# Altium project SecuCar.PrjPcb
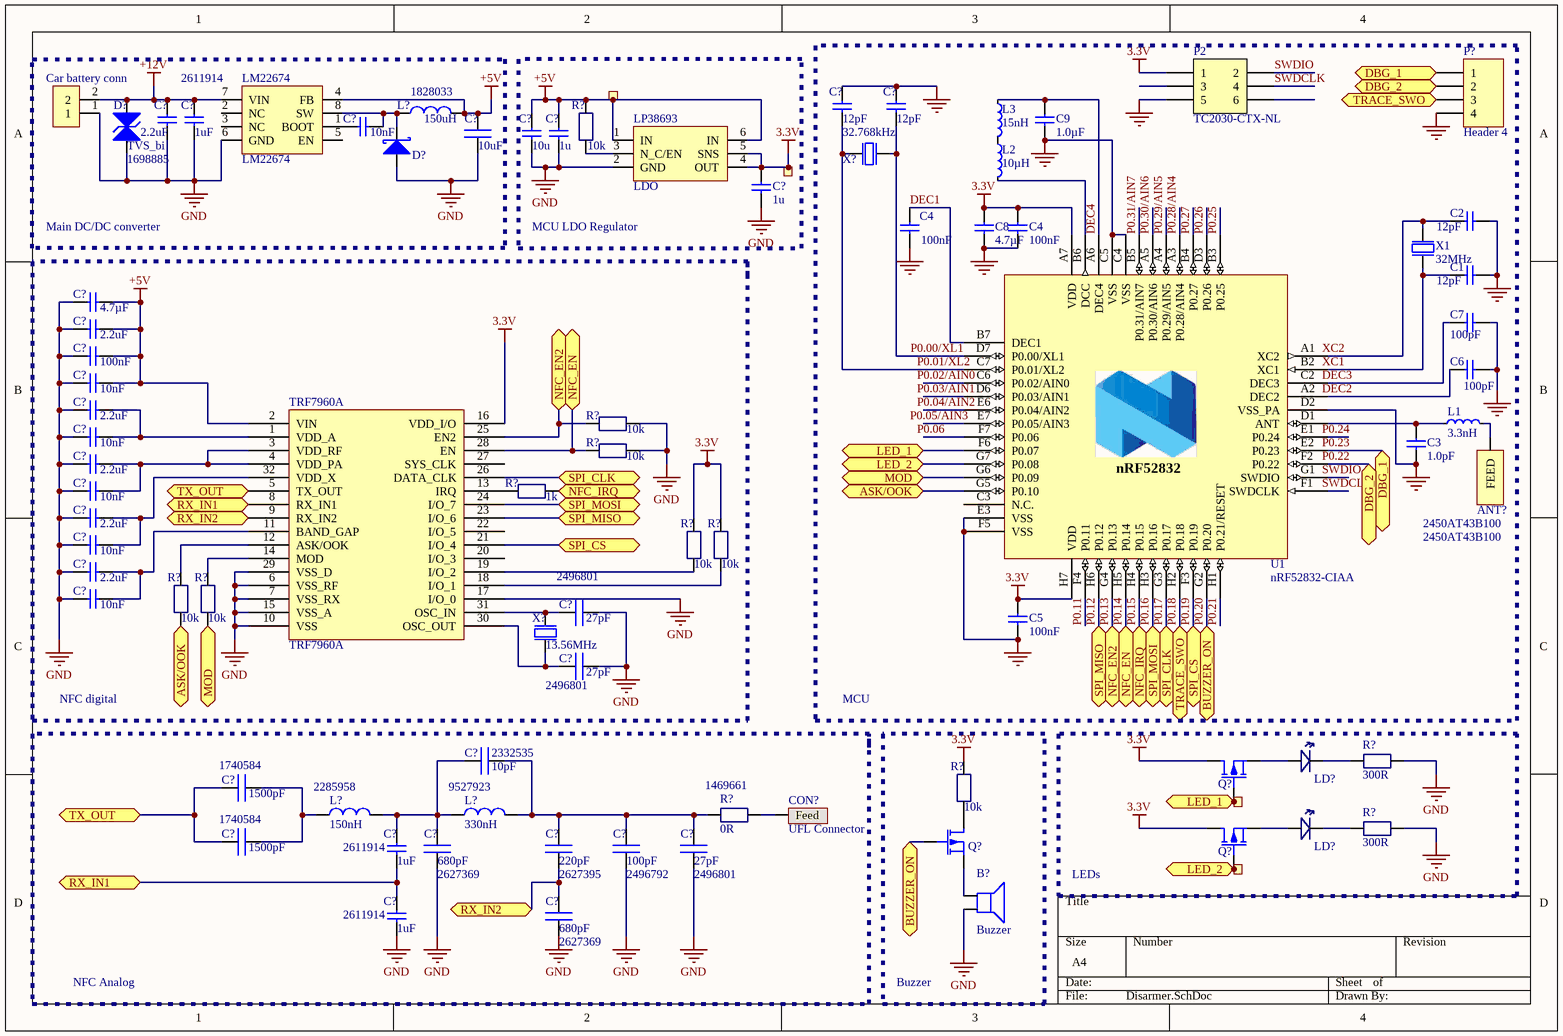
[diagram p0: Disarmer.SchDoc]
3 sheets, 235 parts. Net scope: flat (ports and power ports of the same name join across sheets).
Sheets:
  Disarmer.SchDoc
  MainBoard.SchDoc
  MainBoardPower.SchDoc

## Sheet Disarmer.SchDoc
size A4

### Parts
(Parts that share a designator on the sheet are numbered #1, #2 ... from top to bottom, then left to right.)
?#1  Ø1.0mm,SMD  [TP_SMD_Ř1.0mm]  (value not drawn)  (no BOM)
?#2  Ø1.0mm,SMD  [TP_SMD_Ř1.0mm]  (value not drawn)  (no BOM)
?#3  Ø1.0mm,SMD  [TP_SMD_Ř1.0mm]  (value not drawn)  (no BOM)
?#4  Ø1.0mm,SMD  [TP_SMD_Ř1.0mm]  (value not drawn)  (no BOM)
ANT?#1  2450AT43B100  [2450AT43B100]
B?  Buzzer  [Buzzer_12mm]
C1  12pF  [CAPC0603X03L]
C2  12pF  [CAPC0603X03L]
C3  1.0pF  [CAPC0603X03L]
C4#1  100nF  [CAPC0603X03L]
C4#2  100nF  [CAPC0603X03L]
C5  100nF  [CAPC0603X03L]
C6  100pF  [CAPC0603X03L]
C7  100pF  [CAPC0603X03L]
C8  4.7µF  [CAPC1608X06L]
C9  1.0µF  [CAPC1005X04L]
C?#1  2.2uF  [CAPC1608X06L]
C?#2  1uF  Supplier Part Number 1: 2611914  [CAPC1608X06L]
C?#3  10u  [CAPC1608X06L]
C?#4  1u  [CAPC1608X06L]
C?#5  10nF  [CAPC0603X03L]
C?#6  12pF  [CAPC0603X03L]
C?#7  12pF  [CAPC0603X03L]
C?#8  10uF  [0805]
C?#9  1u  [CAPC1608X06L]
C?#10  4.7µF  [CAPC1608X06L]
C?#11  2.2uF  [CAPC1608X06L]
C?#12  100nF  [CAPC0603X03L]
C?#13  10nF  [CAPC0603X03L]
C?#14  2.2uF  [CAPC1608X06L]
C?#15  10nF  [CAPC0603X03L]
C?#16  2.2uF  [CAPC1608X06L]
C?#17  10nF  [CAPC0603X03L]
C?#18  2.2uF  [CAPC1608X06L]
C?#19  10nF  [CAPC0603X03L]
C?#20  2.2uF  [CAPC1608X06L]
C?#21  10nF  [CAPC0603X03L]
C?#22  27pF  Supplier Part Number 1: 2496801  [0402]
C?#23  27pF  Supplier Part Number 1: 2496801  [0402]
C?#24  10pF  Supplier Part Number 1: 2332535  [0402]
C?#25  1500pF  Supplier Part Number 1: 1740584  [0402]
C?#26  1uF  Supplier Part Number 1: 2611914  [CAPC1608X06L]
C?#27  1500pF  Supplier Part Number 1: 1740584  [0402]
C?#28  27pF  Supplier Part Number 1: 2496801  [0402]
C?#29  680pF  Supplier Part Number 1: 2627369  [0402]
C?#30  220pF  Supplier Part Number 1: 2627395  [0402]
C?#31  100pF  Supplier Part Number 1: 2496792  [0402]
C?#32  1uF  Supplier Part Number 1: 2611914  [CAPC1608X06L]
C?#33  680pF  Supplier Part Number 1: 2627369  [0402]
Car_battery_conn  (no value)  [ARK_3.5mm]
CON?  UFL Connector  [UFL SMD]
D?#1  TVS_bi  Supplier Part Number 1: 1698885  [DO-214-AB]
D?#2  Shottky  [SOD123F]  (value not drawn)
L1  3.3nH  [INDC0603X03L]
L2#1  10µH  [INDC1608X06L]
L3#1  15nH  [INDC1005X04L]
L?#1  150uH  Supplier Part Number 1: 1828033  [8x8]
L?#2  150nH  Supplier Part Number 1: 2285958  [0603]
L?#3  330nH  Supplier Part Number 1: 9527923  [0805]
LD?#1  0603_LED  [LED_0603]  (value not drawn)
LD?#2  0603_LED  [LED_0603]  (value not drawn)
LM22674  LM22674  [HSOP 8-pin]
LP38693#1  LDO  [WSON-6]
P2#1  TC2030-CTX-NL  [TC2030-IDC-NLFP]  (no BOM)
P?#1  Header 4  [HDR1X4]
Q?#1  RZE002P02TLTR-ND  [SOT-416]  (value not drawn)
Q?#2  RZE002P02TLTR-ND  [SOT-416]  (value not drawn)
Q?#3  RZE002P02TLTR-ND  [SOT-416]  (value not drawn)
R?#1  value 10k  [RES_0402]  (hidden comment: RES_0402_1k)
R?#2  value 10k  [RES_0402]  (hidden comment: RES_0402_1k)
R?#3  value 10k  [RES_0402]  (hidden comment: RES_0402_1k)
R?#4  value 1k  [RES_0402]  (hidden comment: RES_0402_1k)
R?#5  value 10k  [RES_0402]  (hidden comment: RES_0402_1k)
R?#6  value 10k  [RES_0402]  (hidden comment: RES_0402_1k)
R?#7  value 10k  [RES_0402]  (hidden comment: RES_0402_1k)
R?#8  value 10k  [RES_0402]  (hidden comment: RES_0402_1k)
R?#9  value 300R  [RES_0402]  (hidden comment: RES_0402_1k)
R?#10  value 10k  [RES_0402]  (hidden comment: RES_0402_1k)
R?#11  value 0R  Supplier Part Number 2: 1469661  [RES_0402]  (hidden comment: RES_0402_1k)
R?#12  value 300R  [RES_0402]  (hidden comment: RES_0402_1k)
TRF7960A  TRF7960A  [RHB32]
U1#1  nRF52832-CIAA  [BGA50C40P7X8_295X322X50]
X1  32MHz  [BT-XTAL_2016]
X?#1  32.768kHz  [XTAL_2012]
X?#2  13.56MHz  [BT-XTAL_2016]

### Blocks framed on the sheet
Main DC/DC converter: C?#1 C?#2 C?#5 C?#8 Car_battery_conn D?#1 D?#2 L?#1 LM22674
MCU LDO Regulator: ?#1 ?#2 C?#3 C?#4 C?#9 LP38693#1 R?#1
MCU: ANT?#1 C1-C3 C4#1 C4#2 C5-C9 C?#6 C?#7 L1 L2#1 L3#1 P2#1 P?#1 U1#1 X1 X?#1
Buzzer: B? Q?#2 R?#10
LEDs: ?#3 ?#4 LD?#1 LD?#2 Q?#1 Q?#3 R?#9 R?#12

### Ports
ASK/OOK, BUZZER_ON, DBG_1, DBG_2, LED_1, LED_2, MOD, NFC_EN, NFC_EN2, NFC_IRQ, RX_IN1, RX_IN2, SPI_CLK, SPI_CS, SPI_MISO, SPI_MOSI, TRACE_SWO, TX_OUT

### Nets
3.3V: ?#2.1 C4#2.1 C5.1 C8.1 C?#9.1 LP38693#1.4(OUT) LP38693#1.5(SNS) P2#1.1 Q?#1.3 Q?#3.3 R?#5.2 R?#6.2 R?#10.1 TRF7960A.16(VDD_I/O) U1#1.A7(VDD) U1#1.H7(VDD)
+5V: ?#1.1 C?#3.1 C?#4.1 C?#8.2 C?#10.2 C?#11.1 C?#12.2 C?#13.2 L?#1.2 LM22674.4(FB) LP38693#1.1(IN) LP38693#1.6(IN) R?#1.2 TRF7960A.2(VIN)
+12V: C?#1.1 C?#2.1 Car_battery_conn.2 D?#1.2 LM22674.7(VIN)
GND: B?.2 C1.1 C2.1 C3.1 C4#1.2 C4#2.2 C5.2 C6.1 C7.2 C8.2 C9.1 C?#1.2 C?#2.2 C?#3.2 C?#4.2 C?#6.2 C?#7.2 C?#8.1 C?#9.2 C?#10.1 C?#11.2 C?#12.1 C?#13.1 C?#14.2 C?#15.1 C?#16.2 C?#17.1 C?#18.2 C?#19.1 C?#20.2 C?#21.1 C?#22.1 C?#23.1 C?#28.2 C?#29.1 C?#31.1 C?#32.2 C?#33.1 Car_battery_conn.1 CON?.2(GND) D?#1.1 D?#2.1 LM22674.6(GND) LP38693#1.2(GND) P2#1.5 P?#1.4 R?#2.1 R?#3.1 R?#9.1 R?#12.1 TRF7960A.6(VSS_RF) TRF7960A.7(VSS_RX) TRF7960A.10(VSS) TRF7960A.15(VSS_A) TRF7960A.17(I/O_0) TRF7960A.29(VSS_D) U1#1.C4(VSS) U1#1.C5(VSS) U1#1.D2(VSS_PA) U1#1.E3(VSS) U1#1.F5(VSS) X1.2(GND) X1.4(GND) X?#2.2(GND) X?#2.4(GND)
DEC1: C4#1.1 U1#1.B7(DEC1)
DEC4: C9.2 L3#1.1 U1#1.A6(DEC4)
P0.00/XL1: C?#7.1 U1#1.D7(P0.00/XL1) X?#1.2(out)
P0.01/XL2: C?#6.1 U1#1.C7(P0.01/XL2) X?#1.1(inp)
P0.11: U1#1.F4(P0.11)
P0.12: TRF7960A.23(I/O_6) U1#1.H6(P0.12) ; port SPI_MISO
P0.13: R?#2.2 TRF7960A.25(EN2) U1#1.G4(P0.13) ; port NFC_EN2
P0.14: R?#3.2 TRF7960A.28(EN) U1#1.H5(P0.14) ; port NFC_EN
P0.15: R?#4.2 U1#1.H4(P0.15) ; port NFC_IRQ
P0.16: TRF7960A.24(I/O_7) U1#1.H3(P0.16) ; port SPI_MOSI
P0.17: TRF7960A.26(DATA_CLK) U1#1.G3(P0.17) ; port SPI_CLK
P0.18: P?#1.3 U1#1.H2(P0.18) ; port TRACE_SWO
P0.19: TRF7960A.21(I/O_4) U1#1.F3(P0.19) ; port SPI_CS
P0.20: Q?#2.1 U1#1.G2(P0.20) ; port BUZZER_ON
P0.21: U1#1.H1(P0.21/RESET)
P0.25: U1#1.B3(P0.25)
P0.26: U1#1.D3(P0.26)
P0.27: U1#1.B4(P0.27)
P0.28/AIN4: U1#1.A3(P0.28/AIN4)
P0.29/AIN5: U1#1.A4(P0.29/AIN5)
P0.30/AIN6: U1#1.A5(P0.30/AIN6)
P0.31/AIN7: U1#1.B5(P0.31/AIN7)
SWDCLK: P2#1.4
SWDIO: P2#1.2
Net?#3_1: ?#3.1 Q?#1.1 U1#1.F6(P0.07) ; port LED_1
Net?#4_1: ?#4.1 Q?#3.1 U1#1.G7(P0.08) ; port LED_2
NetANT?#1_1: ANT?#1.1(FEED) L1.2
NetB?_1: B?.1 Q?#2.2
NetC1_2: C1.2 U1#1.B2(XC1) X1.1(inp)
NetC2_2: C2.2 U1#1.A1(XC2) X1.3(out)
NetC3_2: C3.2 L1.1 U1#1.D1(ANT)
NetC6_2: C6.2 U1#1.A2(DEC2)
NetC7_1: C7.1 U1#1.C2(DEC3)
NetC?#5_1: C?#5.1 D?#2.2 L?#1.1 LM22674.8(SW)
NetC?#5_2: C?#5.2 LM22674.1(BOOT)
NetC?#14_1: C?#14.1 C?#15.2 TRF7960A.1(VDD_A)
NetC?#16_1: C?#16.1 C?#17.2 TRF7960A.3(VDD_RF) TRF7960A.4(VDD_PA)
NetC?#18_1: C?#18.1 C?#19.2 TRF7960A.32(VDD_X)
NetC?#20_1: C?#20.1 C?#21.2 TRF7960A.11(BAND_GAP)
NetC?#22_2: C?#22.2 TRF7960A.31(OSC_IN) X?#2.3(out)
NetC?#23_2: C?#23.2 TRF7960A.30(OSC_OUT) X?#2.1(inp)
NetC?#24_1: C?#24.1 C?#28.1 C?#30.2 C?#31.2 L?#3.2 R?#11.2
NetC?#24_2: C?#24.2 C?#26.1 C?#29.2 L?#2.2 L?#3.1
NetC?#25_1: C?#25.1 C?#27.1 TRF7960A.5(TX_OUT) ; port TX_OUT
NetC?#25_2: C?#25.2 C?#27.2 L?#2.1
NetC?#26_2: C?#26.2 C?#32.1 TRF7960A.8(RX_IN1) ; port RX_IN1
NetC?#30_1: C?#30.1 C?#33.2 TRF7960A.9(RX_IN2) ; port RX_IN2
NetCON?_1: CON?.1(Feed) R?#11.1
NetL2#1_1: L2#1.1 L3#1.2
NetL2#1_2: L2#1.2 U1#1.B6(DCC)
NetLD?#1_1: LD?#1.1(A) Q?#1.2
NetLD?#1_2: LD?#1.2(K) R?#9.2
NetLD?#2_1: LD?#2.1(A) Q?#3.2
NetLD?#2_2: LD?#2.2(K) R?#12.2
NetLP38693#1_3: LP38693#1.3(N_C/EN) R?#1.1
NetP?#1_1: P?#1.1 U1#1.E2(P0.23) ; port DBG_1
NetP?#1_2: P?#1.2 U1#1.F2(P0.22) ; port DBG_2
NetQ?#2_3: Q?#2.3 R?#10.2
NetR?#4_1: R?#4.1 TRF7960A.13(IRQ)
NetR?#5_1: R?#5.1 TRF7960A.19(I/O_2)
NetR?#6_1: R?#6.1 TRF7960A.18(I/O_1)
NetR?#7_1: R?#7.1 U1#1.G5(P0.10) ; port ASK/OOK
NetR?#7_2: R?#7.2 TRF7960A.12(ASK/OOK)
NetR?#8_1: R?#8.1 U1#1.G6(P0.09) ; port MOD
NetR?#8_2: R?#8.2 TRF7960A.14(MOD)

Not connected (* = marked no-connect by the designer): LM22674 2(NC) 3(NC) 5(EN); P2#1 3 6; TRF7960A 20(I/O_3) 22(I/O_5) 27(SYS_CLK); U1#1 C3(N.C.) C6(P0.02/AIN0) D6(P0.03/AIN1) E1(P0.24) E6(P0.04/AIN2) E7(P0.05/AIN3) F1(SWDCLK) F7(P0.06) G1(SWDIO)

### Notes on the sheet
- NFC digital
- NFC Analog
- Labels drawn without touching a wire or pin: DEC2, DEC3, P0.02/AIN0, P0.03/AIN1, P0.04/AIN2, P0.05/AIN3, P0.06, P0.22, P0.23, P0.24, SWDCLK, SWDIO, XC1, XC2
- (in symbol nRF52832-CIAA) nRF52832

### Library data of the parts
?#1-?#4 = TESTPAD: 1.0mm circular SMD testpad; Part Number: TP_SMD_Ø1.0MM; Manufacturer: Nordic Semiconductor; Artikkelnr Noca: N.A.; Manufacturer Part Number: *; Datasheet: *; Footprint: TP_SMD_Ø1.0mm; LatestRevisionDate: 2013-06-11; Pin Count: 1; Publisher: Nordic Semiconductor; Published: 2013-06-11; Value: Ø1.0mm,SMD; Note: *; Supplier: *; Supplier part number: *; 2nd source Supplier: *; 2nd source part number: *
C1 C2 C?#6 C?#7 = C0201-12p: Capacitor, NP0, ±2%; Note: 50V; Artikkelnr Noca: N.A.; Part Number: C0201-12p; Manufacturer: *; Manufacturer Part Number: *; Datasheet: *; LatestRevisionDate: 2014-11-13; Pin Count: 2; Publisher: Nordic Semiconductor; Published: 2014-11-13; Value: 12pF; Supplier: *; Supplier part number: *; 2nd source Supplier: *; 2nd source part number: *; Footprint Doc: 0201; Artikkelnr Simpro: N.A.
C3 = C0201-1.0p: Capacitor, NP0, ±5%; Note: Chip Cap 1%; Artikkelnr Noca: N.A.; Part Number: C0201-1.0p; Manufacturer: *; Manufacturer Part Number: *; Datasheet: *; LatestRevisionDate: 2014-11-13; Pin Count: 2; Publisher: Nordic Semiconductor; Published: 2014-11-13; Value: 1.0pF; Supplier: *; Supplier part number: *; 2nd source Supplier: *; 2nd source part number: *; Footprint Doc: 0201; Artikkelnr Simpro: N.A.
C4#1 C4#2 C5 C?#12 = C0201-100n: Capacitor, X7R, ±10%; Note: 16V; Artikkelnr Noca: N.A.; Part Number: C0201-100n; Manufacturer: *; Manufacturer Part Number: *; Datasheet: *; LatestRevisionDate: 2014-11-13; Pin Count: 2; Publisher: Nordic Semiconductor; Published: 2014-11-13; Value: 100nF; Supplier: *; Supplier part number: *; 2nd source Supplier: *; 2nd source part number: *; Footprint Doc: 0201; Artikkelnr Simpro: N.A.
C6 C7 = C0201-100p: Capacitor, NP0, ±5%; Note: Chip Cap 1%; Artikkelnr Noca: N.A.; Part Number: C0201-100p; Manufacturer: *; Manufacturer Part Number: *; Datasheet: *; LatestRevisionDate: 2014-11-13; Pin Count: 2; Publisher: Nordic Semiconductor; Published: 2014-11-13; Value: 100pF; Supplier: *; Supplier part number: *; 2nd source Supplier: *; 2nd source part number: *; Footprint Doc: 0201; Artikkelnr Simpro: N.A.
C8 C?#10 = C0603-4µ7: Capacitor, X5R, ±10%; Note: 6.3V; Artikkelnr Noca: 20069060; Artikkelnr Simpro: N.A.; Part Number: C0603-4µ7; Manufacturer: *; Manufacturer Part Number: *; Datasheet: *; LatestRevisionDate: 2009-11-23; Pin Count: 2; Publisher: Nordic Semiconductor; Published: 2009-05-08; Value: 4.7µF; Supplier: *; Supplier part number: *; 2nd source Supplier: *; 2nd source part number: *; Footprint Doc: 0603
C9 = C0402-1µ0: Capacitor, X5R, ±5%; Note: 6.3V; Artikkelnr Noca: 20039235; Artikkelnr Simpro: N.A.; Part Number: C0402-1µ0; Manufacturer: *; Manufacturer Part Number: *; Datasheet: *; LatestRevisionDate: 2009-11-23; Pin Count: 2; Publisher: Nordic Semiconductor; Published: 2009-05-08; Value: 1.0µF; Supplier: *; Supplier part number: *; 2nd source Supplier: *; 2nd source part number: *; Footprint Doc: 0402
C?#1-C?#4 C?#9 C?#11 C?#14 C?#16 C?#18 C?#20 C?#26 C?#32 = C0603-4µ7: Capacitor, X5R, ±10%; Value: 4.7µF; Note: 6.3V; Artikkelnr Noca: 20069060; Artikkelnr Simpro: N.A.; Part Number: C0603-4µ7; Manufacturer: *; Manufacturer Part Number: *; Datasheet: *; LatestRevisionDate: 2009-11-23; Pin Count: 2; Publisher: Nordic Semiconductor; Published: 2009-05-08; Supplier: *; Supplier part number: *; 2nd source Supplier: *; 2nd source part number: *; Footprint Doc: 0603
  C?#2 C?#26 C?#32: Supplier 1: Farnell
  C?#3 C?#4 C?#9: Supplier 1: Farnell; Supplier Part Number 1: 1327684
C?#5 C?#13 C?#15 C?#17 C?#19 C?#21 = C0201-100n: Capacitor, X7R, ±10%; Value: 100nF; Note: 16V; Artikkelnr Noca: N.A.; Part Number: C0201-100n; Manufacturer: *; Manufacturer Part Number: *; Datasheet: *; LatestRevisionDate: 2014-11-13; Pin Count: 2; Publisher: Nordic Semiconductor; Published: 2014-11-13; Supplier: *; Supplier part number: *; 2nd source Supplier: *; 2nd source part number: *; Footprint Doc: 0201; Artikkelnr Simpro: N.A.
C?#8 C?#22-C?#25 C?#27-C?#31 C?#33 = Capacitor_MLCC: ?
  C?#22-C?#25 C?#27-C?#31 C?#33: Supplier 1: Farnell
Car_battery_conn = Component_1
D?#1 = TVS_bidirectional: Supplier 1: Farnell
D?#2 = Shottky_diode
L1 = L0201-3n3: High frequency chip inductor ±5%; Artikkelnr Noca: N.A.; Part Number: L0201-3n3; Manufacturer: *; Manufacturer Part Number: *; Datasheet: *; LatestRevisionDate: 2013-04-10; Pin Count: 2; Publisher: Nordic Semiconductor; Published: 2013-04-10; Value: 3.3nH; Note: High frequency chip inductor ±5%; Supplier: *; Supplier part number: *; 2nd source Supplier: *; 2nd source part number: *; Footprint Doc: 0201; Artikkelnr Simpro: N.A.
L2#1 = L0603-10µ: Chip inductor, IDC,min = 50 mA, ±20%; Manufacturer: Taiyo Yuden; Manufacturer Part Number: LBMF1608T100K; 2nd source part number: 178-6105; Note: LBMF1608T100K 10µH 80mA 0603; Artikkelnr Noca: 33029314; Artikkelnr Simpro: N.A.; Part Number: L0603-10µ; Datasheet: http://www.yuden.co.jp/ut/product/pdf/elb2_e.pdf; LatestRevisionDate: 2012-09-19; Pin Count: 2; Publisher: Nordic Semiconductor; Published: 2010-02-24; Value: 10µH; Supplier: Digi-Key; Supplier part number: 587-1714-1-ND; 2nd source Supplier: Farnell; Footprint Doc: 0603
L3#1 = L0402-15n: High frequency chip inductor ±10%; Manufacturer: Taiyo Yuden; Manufacturer Part Number: HK100515NJ-T; 2nd source part number: 658-1328; Artikkelnr Noca: 33029323; Artikkelnr Simpro: N.A.; Part Number: L0402-15n; LatestRevisionDate: 2012-09-19; Pin Count: 2; Publisher: Nordic Semiconductor; Published: 2010-07-12; Value: 15nH; Note: High frequency chip inductor ±10%; Supplier: Digi-Key; Datasheet: http://www.yuden.co.jp/productdata/catalog/en/mlci04_e.pdf; Supplier part number: 587-1521-1-ND; 2nd source Supplier: Farnell; Footprint Doc: 0402
L?#1-L?#3 = Inductor: Supplier 1: Farnell
LD?#1 LD?#2 = LED_0603_Blue: Supplier 1: Digi-Key; Supplier 2: TME; Supplier 3: TME; Supplier 4: TME; Supplier 5: TME; Supplier Part Number 1: 160-1647-2-ND; Supplier Part Number 2: LL-S192PBC-B4-1B; Supplier Part Number 3: LL-S194PBC-B4-1B; Supplier Part Number 4: OF-SMD1608B; Supplier Part Number 5: OSB50603C1D
LP38693#1 = LP38693 WSON Package
P2#1 = TC2030-CTX-NL: CBL PLUG-OF-NAILS 6-PIN; Manufacturer: Tag-Connect LLC; Artikkelnr Noca: N.A.; Part Number: TC2030-CTX-NL; Manufacturer Part Number: TC2030-CTX-NL; Datasheet: http://www.tag-connect.com/Materials/TC2030-IDC-NL.pdf; LatestRevisionDate: 2013-08-08; Pin Count: 6; Publisher: Nordic Semiconductor; Published: 2013-08-08; Value: TC2030-CTX-NL; Supplier: Tag-Connect; Supplier part number: TC2030-CTX-NL; 2nd source Supplier: *; 2nd source part number: *
P?#1 = Header 4: Header, 4-Pin; LatestRevisionDate: 17-Jul-2002; LatestRevisionNote: Re-released for DXP Platform.; Publisher: Altium Limited
U1#1 = nRF52832-CIAA: Multi-protocol Bluetooth Low Energy, ANT and 2.4GHz proprietary system-on-chip; Manufacturer: Nordic Semiconductor; Artikkelnr Noca: N.A.; Part Number: nRF52832-CIAA; Manufacturer Part Number: nRF52832-CIAA; Datasheet: *; LatestRevisionDate: 2016-03-11; Pin Count: 54; Publisher: Nordic Semiconductor; Published: 2016-03-11; Value: nRF52832-CIAA; Note: *; Supplier: Nordic Semiconductor; Supplier part number: *; 2nd source Supplier: *; 2nd source part number: *; Footprint Doc: WLCSP_C50; Artikkelnr Simpro: N.A.; Part number IPS: N.A.
X1 X?#2 = XTAL_SMD2016_32MHz_8pF_Epson: XTAL SMD 2016, 32MHz, Cl=8pF, Total Tol: ±40ppm; Manufacturer: Epson Toyocom; Manufacturer Part Number: Q22FA12800025; Note: XTAL SMD 32.000MHz; Artikkelnr Noca: N.A.; Part Number: XTAL_SMD2016_32MHz_8pF_Epson; Datasheet: http://www.epsondevice.com/docs/qd/en/DownloadServlet?id=ID000449; LatestRevisionDate: 2014-11-27; Pin Count: 4; Publisher: Nordic Semiconductor; Published: 2012-03-09; Value: 32MHz; Supplier: Farnell; Supplier part number: 171-2806; 2nd source Supplier: *; 2nd source part number: *; Footprint Doc: XTAL_2016; Artikkelnr Simpro: N.A.
X?#1 = XTAL_SMD2012_32.768kHz_9pF_Seiko: XTAL SMD 2012, 32.768kHz, Cl=9pF, Total Tol: ±50ppm; Manufacturer: Seiko; Manufacturer Part Number: SC20S-9.0PF20PPM; Note: XTAL SMD 32.768kHz, 2012; Artikkelnr Noca: N.A.; Part Number: XTAL_SMD2012_32.768kHz_9pF_Seiko; Datasheet: http://www.sii.co.jp/en/quartz/files/2013/03/file_PRODUCT_MASTER_50811_GRAPHIC03.pdf; LatestRevisionDate: 2015-10-15; Pin Count: 2; Publisher: Nordic Semiconductor; Published: 2015-10-15; Value: 32.768kHz; Supplier: *; Supplier part number: *; 2nd source Supplier: *; 2nd source part number: *; Footprint Doc: XTAL_2012; Artikkelnr Simpro: N.A.
ANT?#1 = 2450AT43B100: Supplier 1: Mouser; Supplier 2: Farnell; Supplier 3: Farnell; Supplier 4: Digi-Key; Supplier 5: Digi-Key; Supplier 6: Digi-Key; Supplier Part Number 1: 609-2450AT43B100E; Supplier Part Number 2: 2148524; Supplier Part Number 3: 2148524RL; Supplier Part Number 4: 712-1010-2-ND; Supplier Part Number 5: 712-1010-1-ND; Supplier Part Number 6: 712-1010-6-ND; Value: 2450AT43B100
CON? = UFL Connector: Supplier 1: Digi-Key; Supplier 2: Digi-Key; Supplier 3: Digi-Key; Supplier 4: Digi-Key; Supplier 5: Digi-Key; Supplier 6: Digi-Key; Supplier 7: Farnell; Supplier 8: Farnell; Supplier Part Number 1: H9161DKR-ND; Supplier Part Number 2: H11891CT-ND; Supplier Part Number 3: H11891DKR-ND; Supplier Part Number 4: H9161CT-ND; Supplier Part Number 5: H9161TR-ND; Supplier Part Number 6: H11891TR-ND; Supplier Part Number 7: 1688077; Supplier Part Number 8: 1688077RL
Q?#1-Q?#3 = RZE002P02TLTR-ND: Supplier 1: Digi-Key; Supplier 2: Digi-Key; Supplier 3: Digi-Key; Supplier Part Number 1: RZE002P02TLTR-ND; Supplier Part Number 2: RZE002P02TLCT-ND; Supplier Part Number 3: RZE002P02TLDKR-ND; Value: RZE002P02TL
R?#1-R?#12 = RES_0402_1k: Supplier 2: Farnell
  R?#1-R?#10 R?#12: Supplier 1: Digi-Key; Supplier 3: Mouser; Supplier Part Number 1: 311-1.0KJRTR-ND; Supplier Part Number 2: 1358043; Supplier Part Number 3: 603-RC0402FR-071KL
  R?#11: Supplier 1: Mouser; Supplier Part Number 1: 603-RC0402FR-071KL

## Sheet MainBoard.SchDoc
size A4
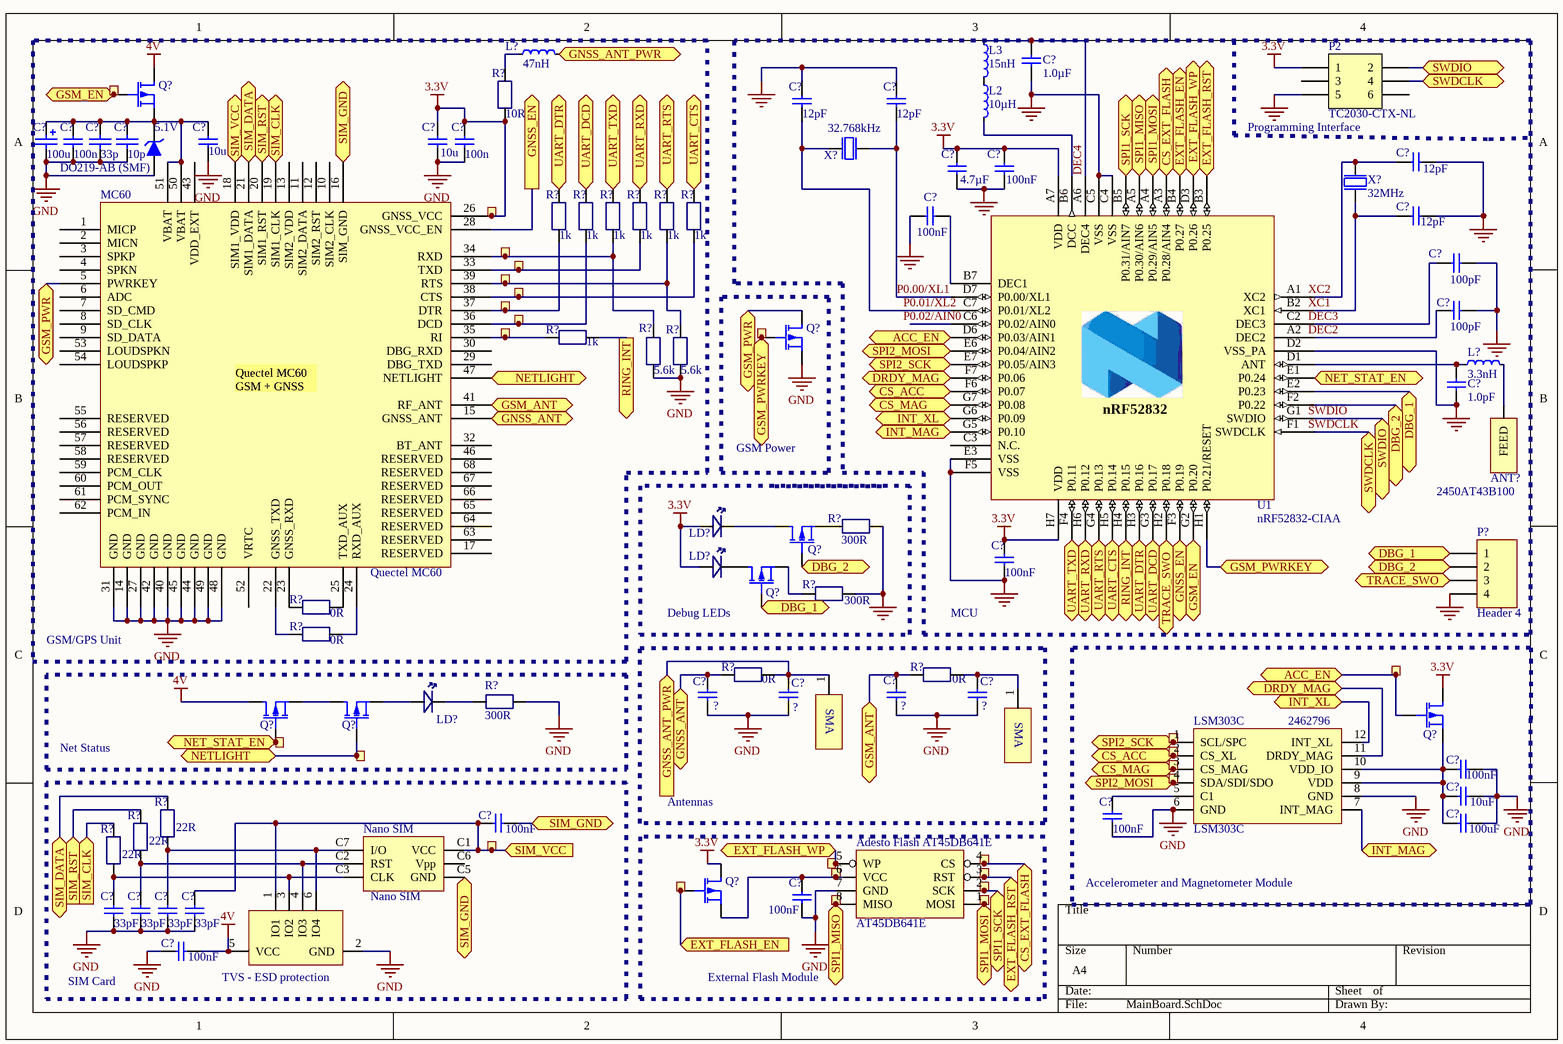
[diagram p1: MainBoard.SchDoc]

### Parts
(Parts that share a designator on the sheet are numbered #1, #2 ... from top to bottom, then left to right.)
5.1V  DO219-AB (SMF)  [DO219-AB]
?#5  Ø1.0mm,SMD  [TP_SMD_Ř1.0mm]  (value not drawn)  (no BOM)
?#6  Ø1.0mm,SMD  [TP_SMD_Ř1.0mm]  (value not drawn)  (no BOM)
?#7  Ø1.0mm,SMD  [TP_SMD_Ř1.0mm]  (value not drawn)  (no BOM)
?#8  Ø1.0mm,SMD  [TP_SMD_Ř1.0mm]  (value not drawn)  (no BOM)
?#9  Ø1.0mm,SMD  [TP_SMD_Ř1.0mm]  (value not drawn)  (no BOM)
?#10  Ø1.0mm,SMD  [TP_SMD_Ř1.0mm]  (value not drawn)  (no BOM)
?#11  Ø1.0mm,SMD  [TP_SMD_Ř1.0mm]  (value not drawn)  (no BOM)
?#12  Ø1.0mm,SMD  [TP_SMD_Ř1.0mm]  (value not drawn)  (no BOM)
?#13  Ø1.0mm,SMD  [TP_SMD_Ř1.0mm]  (value not drawn)  (no BOM)
?#14  Ø1.0mm,SMD  [TP_SMD_Ř1.0mm]  (value not drawn)  (no BOM)
?#15  Ø1.0mm,SMD  [TP_SMD_Ř1.0mm]  (value not drawn)  (no BOM)
?#16  Ø1.0mm,SMD  [TP_SMD_Ř1.0mm]  (value not drawn)  (no BOM)
?#17  Ø1.0mm,SMD  [TP_SMD_Ř1.0mm]  (value not drawn)  (no BOM)
?#18  Ø1.0mm,SMD  [TP_SMD_Ř1.0mm]  (value not drawn)  (no BOM)
?#19  Ø1.0mm,SMD  [TP_SMD_Ř1.0mm]  (value not drawn)  (no BOM)
?#20  Ø1.0mm,SMD  [TP_SMD_Ř1.0mm]  (value not drawn)  (no BOM)
?#21  Ø1.0mm,SMD  [TP_SMD_Ř1.0mm]  (value not drawn)  (no BOM)
?#22  Ø1.0mm,SMD  [TP_SMD_Ř1.0mm]  (value not drawn)  (no BOM)
?#23  Ø1.0mm,SMD  [TP_SMD_Ř1.0mm]  (value not drawn)  (no BOM)
?#24  Ø1.0mm,SMD  [TP_SMD_Ř1.0mm]  (value not drawn)  (no BOM)
?#25  Ø1.0mm,SMD  [TP_SMD_Ř1.0mm]  (value not drawn)  (no BOM)
?#26  Ø1.0mm,SMD  [TP_SMD_Ř1.0mm]  (value not drawn)  (no BOM)
?#27  Ø1.0mm,SMD  [TP_SMD_Ř1.0mm]  (value not drawn)  (no BOM)
?#28  Ø1.0mm,SMD  [TP_SMD_Ř1.0mm]  (value not drawn)  (no BOM)
?#29  Ø1.0mm,SMD  [TP_SMD_Ř1.0mm]  (value not drawn)  (no BOM)
?#30  Ø1.0mm,SMD  [TP_SMD_Ř1.0mm]  (value not drawn)  (no BOM)
?#31  TVS - ESD protection  [SO-G6/P.95]
Adesto_Flash_AT45DB641E  AT45DB641E  [UDFN 5x6mm 8pin]
ANT?#2  2450AT43B100  [2450AT43B100]
C?#34  1.0µF  [CAPC1005X04L]
C?#35  10u  [CAPC1608X06L]
C?#36  10u  [CAPC1608X06L]
C?#37  12pF  [CAPC0603X03L]
C?#38  12pF  [CAPC0603X03L]
C?#39  value 100u  [B]
C?#40  value 33p  [1608[0603]]
C?#41  value 10p  [1608[0603]]
C?#42  4.7µF  [CAPC1608X06L]
C?#43  100n  [CAPC1005X04L]
C?#44  100n  [CAPC1005X04L]
C?#45  12pF  [CAPC0603X03L]
C?#46  100nF  [CAPC1005X04L]
C?#47  100nF  [CAPC1005X04L]
C?#48  12pF  [CAPC0603X03L]
C?#49  100pF  [CAPC0603X03L]
C?#50  100pF  [CAPC0603X03L]
C?#51  1.0pF  [CAPC0603X03L]
C?#52  100nF  [CAPC1005X04L]
C?#53  ?  [CAPC1005X04L]
C?#54  ?  [CAPC1005X04L]
C?#55  ?  [CAPC1005X04L]
C?#56  ?  [CAPC1005X04L]
C?#57  100nF  [CAPC1005X04L]
C?#58  10uF  [CAPC1005X04L]
C?#59  100nF  [CAPC1005X04L]
C?#60  100uF  [CAPC1005X04L]
C?#61  100nF  [CAPC1005X04L]
C?#62  33pF  [CAPC1005X04L]
C?#63  33pF  [CAPC1005X04L]
C?#64  33pF  [CAPC1005X04L]
C?#65  100nF  [CAPC1005X04L]
C?#66  33pF  [CAPC1005X04L]
C?#67  100nF  [CAPC1005X04L]
L2#2  10µH  [INDC1608X06L]
L3#2  15nH  [INDC1005X04L]
L?#4  47nH  [INDC1005X04L]
L?#5  3.3nH  [INDC0603X03L]
LD?#3  0603_LED  [LED_0603]  (value not drawn)
LD?#4  0603_LED  [LED_0603]  (value not drawn)
LD?#5  0603_LED  [LED_0603]  (value not drawn)
LSM303C  LSM303C  Supplier Part Number 1: 2462796  [LGA-12]
MC60  Quectel MC60  [Quactel MC60 Footprint]
Nano_SIM  Nano SIM  [NANO_Sim_Holder]
P2#2  TC2030-CTX-NL  [TC2030-IDC-NLFP]  (no BOM)
P?#2  Header 4  [HDR1X4]
Q?#4  RZE002P02TLTR-ND  [SOT-416]  (value not drawn)
Q?#5  RZE002P02TLTR-ND  [SOT-416]  (value not drawn)
Q?#6  RZE002P02TLTR-ND  [SOT-416]  (value not drawn)
Q?#7  RZE002P02TLTR-ND  [SOT-416]  (value not drawn)
Q?#8  RZE002P02TLTR-ND  [SOT-416]  (value not drawn)
Q?#9  RZE002P02TLTR-ND  [SOT-416]  (value not drawn)
Q?#10  RZE002P02TLTR-ND  [SOT-416]  (value not drawn)
Q?#11  RZE002P02TLTR-ND  [SOT-416]  (value not drawn)
R?#13  value 10R  [RES_0402]  (hidden comment: RES_0402_1k)
R?#14  value 1k  [RES_0402]  (hidden comment: RES_0402_1k)
R?#15  value 1k  [RES_0402]  (hidden comment: RES_0402_1k)
R?#16  value 1k  [RES_0402]  (hidden comment: RES_0402_1k)
R?#17  value 1k  [RES_0402]  (hidden comment: RES_0402_1k)
R?#18  value 1k  [RES_0402]  (hidden comment: RES_0402_1k)
R?#19  value 1k  [RES_0402]  (hidden comment: RES_0402_1k)
R?#20  value 1k  [RES_0402]  (hidden comment: RES_0402_1k)
R?#21  value 5.6k  [RES_0402]  (hidden comment: RES_0402_1k)
R?#22  value 5.6k  [RES_0402]  (hidden comment: RES_0402_1k)
R?#23  value 300R  [RES_0402]  (hidden comment: RES_0402_1k)
R?#24  value 300R  [RES_0402]  (hidden comment: RES_0402_1k)
R?#25  value 0R  [RES_0402]  (hidden comment: RES_0402_1k)
R?#26  value 0R  [RES_0402]  (hidden comment: RES_0402_1k)
R?#27  value 0R  [RES_0402]  (hidden comment: RES_0402_1k)
R?#28  value 0R  [RES_0402]  (hidden comment: RES_0402_1k)
R?#29  value 300R  [RES_0402]  (hidden comment: RES_0402_1k)
R?#30  value 22R  [RES_0402]  (hidden comment: RES_0402_1k)
R?#31  value 22R  [RES_0402]  (hidden comment: RES_0402_1k)
R?#32  value 22R  [RES_0402]  (hidden comment: RES_0402_1k)
SMA_connector#1  GNSS_SMA  [SMA_Footprint]  (value not drawn)
SMA_connector#2  GSM_SMA  [SMA_Footprint]  (value not drawn)
U1#2  nRF52832-CIAA  [BGA50C40P7X8_295X322X50]
X?#3  32.768kHz  [XTAL_2012]
X?#4  32MHz  [BT-XTAL_2016]

### Blocks framed on the sheet
GSM/GPS Unit: 5.1V ?#5-?#13 C?#35 C?#36 C?#39-C?#41 C?#43 C?#44 L?#4 MC60 Q?#4 R?#13-R?#22 R?#25 R?#26
GSM Power: ?#14 Q?#5
Debug LEDs: LD?#3 LD?#4 Q?#6 Q?#7 R?#23 R?#24
Net Status: ?#16 ?#18 LD?#5 Q?#8 Q?#9 R?#29
Antennas: C?#53-C?#56 R?#27 R?#28 SMA_connector#1 SMA_connector#2
SIM Card: ?#22 ?#31 C?#59 C?#62-C?#64 C?#66 C?#67 Nano_SIM R?#30-R?#32

### Ports
ACC_EN, CS_ACC, CS_EXT_FLASH, CS_MAG, DBG_1, DBG_1 (in), DBG_2, DBG_2 (in), DRDY_MAG, EXT_FLASH_EN (in), EXT_FLASH_RST, EXT_FLASH_WP, GNSS_ANT, GNSS_ANT_PWR (in), GNSS_ANT_PWR (out), GNSS_EN (in), GNSS_EN (out), GSM_ANT, GSM_EN (in), GSM_EN (out), GSM_PWR, GSM_PWRKEY, INT_MAG, INT_XL, NET_STAT_EN, NETLIGHT, RING_INT (in), RING_INT (out), SIM_CLK (in), SIM_DATA, SIM_GND, SIM_RST (in), SIM_VCC (in), SPI1_MISO, SPI1_MOSI, SPI1_SCK, SPI2_MOSI, SPI2_SCK, SWDCLK, SWDIO, TRACE_SWO, UART_CTS, UART_DCD (in), UART_DTR (in), UART_RTS, UART_RXD (in), UART_RXD (out), UART_TXD (in), UART_TXD (out)

### Nets
3.3V: ?#6.1 C?#36.1 C?#42.1 C?#44.2 C?#46.2 C?#52.2 LD?#3.1(A) LD?#4.1(A) MC60.26(GNSS_VCC) P2#2.1 Q?#10.3 Q?#11.3 R?#13.2 U1#2.A7(VDD) U1#2.H7(VDD)
4V: ?#31.5(VCC) C?#67.2 Q?#4.3 Q?#8.3
GND: 5.1V.1(A) ?#31.2(GND) Adesto_Flash_AT45DB641E.7(GND) C?#34.1 C?#35.2 C?#36.2 C?#37.2 C?#38.2 C?#39.2 C?#40.1 C?#41.1 C?#42.2 C?#43.1 C?#44.1 C?#45.1 C?#46.1 C?#47.2 C?#48.1 C?#49.2 C?#50.1 C?#51.1 C?#52.1 C?#53.2 C?#54.2 C?#55.2 C?#56.2 C?#57.2 C?#58.1 C?#60.1 C?#61.1 C?#62.2 C?#63.2 C?#64.2 C?#65.1 C?#66.1 C?#67.1 LSM303C.6(GND) LSM303C.8(GND) MC60.14(GND) MC60.27(GND) MC60.31(GND) MC60.40(GND) MC60.42(GND) MC60.44(GND) MC60.45(GND) MC60.48(GND) MC60.49(GND) P2#2.5 P?#2.4 Q?#5.2 R?#21.1 R?#22.1 R?#23.1 R?#24.1 R?#29.1 U1#2.C4(VSS) U1#2.C5(VSS) U1#2.D2(VSS_PA) U1#2.E3(VSS) U1#2.F5(VSS) X?#4.2(GND) X?#4.4(GND)
DEC4: C?#34.2 L3#2.1 U1#2.A6(DEC4)
P0.00/XL1: C?#38.1 U1#2.D7(P0.00/XL1) X?#3.2(out)
P0.01/XL2: C?#37.1 U1#2.C7(P0.01/XL2) X?#3.1(inp)
P0.18: P?#2.3 U1#2.H2(P0.18) ; port TRACE_SWO
Net5.1V_2: 5.1V.2(K) C?#35.1 C?#39.1 C?#40.2 C?#41.2 C?#43.2 MC60.50(VBAT) MC60.51(VBAT) Q?#4.2
Net?#5_1: ?#5.1 Q?#4.1 U1#2.G2(P0.20) ; port GSM_EN
Net?#7_1: ?#7.1 MC60.34(RXD) R?#16.1 R?#21.2
Net?#8_1: ?#8.1 MC60.33(TXD) R?#17.1
Net?#9_1: ?#9.1 MC60.39(RTS) R?#18.1 R?#22.2
Net?#10_1: ?#10.1 MC60.38(CTS) R?#19.1
Net?#11_1: ?#11.1 MC60.37(DTR) R?#14.2
Net?#12_1: ?#12.1 MC60.36(DCD) R?#15.2
Net?#13_1: ?#13.1 MC60.35(RI) R?#20.2
Net?#14_1: ?#14.1 Q?#5.1 U1#2.H1(P0.21/RESET) ; port GSM_PWRKEY
Net?#15_1: ?#15.1 Q?#10.1 U1#2.D6(P0.03/AIN1) ; port ACC_EN
Net?#16_1: ?#16.1 Q?#8.1 U1#2.E1(P0.24) ; port NET_STAT_EN
Net?#17_1: ?#17.1 LSM303C.1(SCL/SPC) U1#2.E7(P0.05/AIN3) ; port SPI2_SCK
Net?#18_1: ?#18.1 MC60.47(NETLIGHT) Q?#9.1 ; port NETLIGHT
Net?#19_1: ?#19.1 LSM303C.2(CS_XL) U1#2.F6(P0.07) ; port CS_ACC
Net?#20_1: ?#20.1 LSM303C.3(CS_MAG) U1#2.G7(P0.08) ; port CS_MAG
Net?#21_1: ?#21.1 LSM303C.4(SDA/SDI/SDO) U1#2.E6(P0.04/AIN2) ; port SPI2_MOSI
Net?#22_1: ?#22.1 ?#31.1(IO1) C?#59.1 C?#64.1 MC60.18(SIM1_VDD) Nano_SIM.C1(VCC) ; port SIM_VCC
Net?#23_1: ?#23.1 Adesto_Flash_AT45DB641E.5(WP) U1#2.D3(P0.26) ; port EXT_FLASH_WP
Net?#24_1: ?#24.1 Adesto_Flash_AT45DB641E.4(CS) U1#2.A3(P0.28/AIN4) ; port CS_EXT_FLASH
Net?#25_1: ?#25.1 Adesto_Flash_AT45DB641E.6(VCC) C?#65.2 Q?#11.2
Net?#26_1: ?#26.1 Adesto_Flash_AT45DB641E.3(RST) U1#2.B3(P0.25) ; port EXT_FLASH_RST
Net?#27_1: ?#27.1 Q?#11.1 U1#2.B4(P0.27) ; port EXT_FLASH_EN
Net?#28_1: ?#28.1 Adesto_Flash_AT45DB641E.2(SCK) U1#2.B5(P0.31/AIN7) ; port SPI1_SCK
Net?#29_1: ?#29.1 Adesto_Flash_AT45DB641E.8(MISO) U1#2.A5(P0.30/AIN6) ; port SPI1_MISO
Net?#30_1: ?#30.1 Adesto_Flash_AT45DB641E.1(MOSI) U1#2.A4(P0.29/AIN5) ; port SPI1_MOSI
Net?#31_3: ?#31.3(IO2) C?#62.1 Nano_SIM.C3(CLK) R?#32.2
Net?#31_4: ?#31.4(IO3) C?#63.1 Nano_SIM.C2(RST) R?#31.2
Net?#31_6: ?#31.6(IO4) C?#66.2 Nano_SIM.C7(I/O) R?#30.2
NetANT?#2_1: ANT?#2.1(FEED) L?#5.2
NetC?#45_2: C?#45.2 U1#2.A1(XC2) X?#4.3(out)
NetC?#47_1: C?#47.1 U1#2.B7(DEC1)
NetC?#48_2: C?#48.2 U1#2.B2(XC1) X?#4.1(inp)
NetC?#49_1: C?#49.1 U1#2.C2(DEC3)
NetC?#50_2: C?#50.2 U1#2.A2(DEC2)
NetC?#51_2: C?#51.2 L?#5.1 U1#2.D1(ANT)
NetC?#53_1: C?#53.1 MC60.15(GNSS_ANT) R?#27.1 ; port GNSS_ANT
NetC?#54_1: C?#54.1 L?#4.2 R?#27.2 SMA_connector#1.1 ; port GNSS_ANT_PWR
NetC?#55_1: C?#55.1 MC60.41(RF_ANT) R?#28.2 ; port GSM_ANT
NetC?#56_1: C?#56.1 R?#28.1 SMA_connector#2.1
NetC?#57_1: C?#57.1 C?#58.2 C?#60.2 LSM303C.9(VDD) LSM303C.10(VDD_IO) Q?#10.2
NetC?#59_2: C?#59.2 MC60.16(SIM_GND) Nano_SIM.C5(GND) ; port SIM_GND
NetC?#61_2: C?#61.2 LSM303C.5(C1)
NetL2#2_1: L2#2.1 L3#2.2
NetL2#2_2: L2#2.2 U1#2.B6(DCC)
NetL?#4_1: L?#4.1 R?#13.1
NetLD?#3_2: LD?#3.2(K) Q?#6.3
NetLD?#4_2: LD?#4.2(K) Q?#7.3
NetLD?#5_1: LD?#5.1(A) Q?#9.2
NetLD?#5_2: LD?#5.2(K) R?#29.2
NetLSM303C_7: LSM303C.7(INT_MAG) U1#2.G5(P0.10) ; port INT_MAG
NetLSM303C_11: LSM303C.11(DRDY_MAG) U1#2.F7(P0.06) ; port DRDY_MAG
NetLSM303C_12: LSM303C.12(INT_XL) U1#2.G6(P0.09) ; port INT_XL
NetMC60_5: MC60.5(PWRKEY) Q?#5.3 ; port GSM_PWR
NetMC60_19: MC60.19(SIM1_CLK) R?#32.1 ; port SIM_CLK
NetMC60_20: MC60.20(SIM1_RST) R?#31.1 ; port SIM_RST
NetMC60_21: MC60.21(SIM1_DATA) R?#30.1 ; port SIM_DATA
NetMC60_22: MC60.22(GNSS_TXD) R?#26.1
NetMC60_23: MC60.23(GNSS_RXD) R?#25.1
NetMC60_24: MC60.24(RXD_AUX) R?#26.2
NetMC60_25: MC60.25(TXD_AUX) R?#25.2
NetMC60_28: MC60.28(GNSS_VCC_EN) U1#2.F3(P0.19) ; port GNSS_EN
NetP2#2_2: P2#2.2 U1#2.G1(SWDIO) ; port SWDIO
NetP2#2_4: P2#2.4 U1#2.F1(SWDCLK) ; port SWDCLK
NetP?#1_1: P?#2.1 Q?#7.1 U1#2.E2(P0.23) ; port DBG_1
NetP?#1_2: P?#2.2 Q?#6.1 U1#2.F2(P0.22) ; port DBG_2
NetQ?#6_2: Q?#6.2 R?#23.2
NetQ?#7_2: Q?#7.2 R?#24.2
NetQ?#8_2: Q?#8.2 Q?#9.3
NetR?#14_1: R?#14.1 U1#2.H3(P0.16) ; port UART_DTR
NetR?#15_1: R?#15.1 U1#2.G3(P0.17) ; port UART_DCD
NetR?#16_2: R?#16.2 U1#2.F4(P0.11) ; port UART_TXD
NetR?#17_2: R?#17.2 U1#2.H6(P0.12) ; port UART_RXD
NetR?#18_2: R?#18.2 U1#2.G4(P0.13) ; port UART_RTS
NetR?#19_2: R?#19.2 U1#2.H5(P0.14) ; port UART_CTS
NetR?#20_1: R?#20.1 U1#2.H4(P0.15) ; port RING_INT

Not connected (* = marked no-connect by the designer): MC60 1(MICP) 2(MICN) 3(SPKP) 4(SPKN) 6(ADC) 7(SD_CMD) 8(SD_CLK) 9(SD_DATA) 10(SIM2_CLK) 11(SIM2_DATA) 12(SIM2_RST) 13(SIM2_VDD) 17(RESERVED) 29(DBG_TXD) 30(DBG_RXD) 32(BT_ANT) 43(VDD_EXT) 46(RESERVED) 52(VRTC) 53(LOUDSPKN) 54(LOUDSPKP) 55(RESERVED) 56(RESERVED) 57(RESERVED) 58(RESERVED) 59(PCM_CLK) 60(PCM_OUT) 61(PCM_SYNC) 62(PCM_IN) 63(RESERVED) 64(RESERVED) 65(RESERVED) 66(RESERVED) 67(RESERVED) 68(RESERVED); Nano_SIM C6(Vpp); P2#2 3 6; U1#2 C3(N.C.) C6(P0.02/AIN0)

### Notes on the sheet
- Programming Interface
- MCU
- Accelerometer and Magnetometer Module
- External Flash Module
- Labels drawn without touching a wire or pin: DEC2, DEC3, P0.02/AIN0, SWDCLK, SWDIO, XC1, XC2
- (in symbol Component_1) SMA
- (in symbol nRF52832-CIAA) nRF52832
- (in symbol Quectel MC60) Quectel MC60 / GSM + GNSS /

### Library data of the parts
5.1V = Zener Diode: Supplier 1: Farnell; Supplier Part Number 1: 1703019
?#5-?#30 = TESTPAD: as ?#1 on sheet Disarmer; Manufacturer Part Number: *; Datasheet: *; Footprint: TP_SMD_Ø1.0mm; LatestRevisionDate: 2013-06-11; Pin Count: 1; Publisher: Nordic Semiconductor; Published: 2013-06-11; Value: Ø1.0mm,SMD; Note: *; Supplier: *; Supplier part number: *; 2nd source Supplier: *; 2nd source part number: *
?#31 = TPD4E001-DBV
C?#34 = C0402-1µ0: as C9 on sheet Disarmer; Part Number: C0402-1µ0; Manufacturer: *; Manufacturer Part Number: *; Datasheet: *; LatestRevisionDate: 2009-11-23; Pin Count: 2; Publisher: Nordic Semiconductor; Published: 2009-05-08; Value: 1.0µF; Supplier: *; Supplier part number: *; 2nd source Supplier: *; 2nd source part number: *; Footprint Doc: 0402
C?#35 C?#36 = C0603-4µ7: as C?#1 on sheet Disarmer; Part Number: C0603-4µ7; Manufacturer: *; Manufacturer Part Number: *; Datasheet: *; LatestRevisionDate: 2009-11-23; Pin Count: 2; Publisher: Nordic Semiconductor; Published: 2009-05-08; Supplier: *; Supplier part number: *; 2nd source Supplier: *; 2nd source part number: *; Footprint Doc: 0603
C?#37 C?#38 C?#45 C?#48 = C0201-12p: as C1 on sheet Disarmer; Part Number: C0201-12p; Manufacturer: *; Manufacturer Part Number: *; Datasheet: *; LatestRevisionDate: 2014-11-13; Pin Count: 2; Publisher: Nordic Semiconductor; Published: 2014-11-13; Value: 12pF; Supplier: *; Supplier part number: *; 2nd source Supplier: *; 2nd source part number: *; Footprint Doc: 0201; Artikkelnr Simpro: N.A.
C?#39 = CAP_B_100u: Solid Tantalum Capacitor; Supplier 1: Farnell; Supplier Part Number 1: 1658510
C?#40 C?#41 = Cap Semi: Capacitor (Semiconductor SIM Model); Published: 8-Jun-2000; LatestRevisionDate: 29-May-2009; LatestRevisionNote: IPC-7351 Footprint Added.; PackageReference: C1206; Publisher: Altium Limited; PackageDescription: Chip Capacitor; Supplier 1: Farnell
  C?#40: Supplier Part Number 1: 1907290
  C?#41: Supplier Part Number 1: 2309035
C?#42 = C0603-4µ7: as C8 on sheet Disarmer; Part Number: C0603-4µ7; Manufacturer: *; Manufacturer Part Number: *; Datasheet: *; LatestRevisionDate: 2009-11-23; Pin Count: 2; Publisher: Nordic Semiconductor; Published: 2009-05-08; Value: 4.7µF; Supplier: *; Supplier part number: *; 2nd source Supplier: *; 2nd source part number: *; Footprint Doc: 0603
C?#43 C?#44 C?#46 C?#47 C?#52-C?#67 = CAP_0402: Capacitor, NP0, ±2%; Part Number: C0402-12p; Value: 12pF; Note: 50V; Artikkelnr Noca: 20029159; Artikkelnr Simpro: N.A.; Manufacturer: *; Manufacturer Part Number: *; Datasheet: *; LatestRevisionDate: 2011-05-11; Pin Count: 2; Publisher: Nordic Semiconductor; Published: 2009-05-08; Supplier: *; Supplier part number: *; 2nd source Supplier: *; 2nd source part number: *; Footprint Doc: 0402
  C?#58: Supplier 1: Farnell; Supplier Part Number 1: 2218854
C?#49 C?#50 = C0201-100p: as C6 on sheet Disarmer; Part Number: C0201-100p; Manufacturer: *; Manufacturer Part Number: *; Datasheet: *; LatestRevisionDate: 2014-11-13; Pin Count: 2; Publisher: Nordic Semiconductor; Published: 2014-11-13; Value: 100pF; Supplier: *; Supplier part number: *; 2nd source Supplier: *; 2nd source part number: *; Footprint Doc: 0201; Artikkelnr Simpro: N.A.
C?#51 = C0201-1.0p: as C3 on sheet Disarmer; Part Number: C0201-1.0p; Manufacturer: *; Manufacturer Part Number: *; Datasheet: *; LatestRevisionDate: 2014-11-13; Pin Count: 2; Publisher: Nordic Semiconductor; Published: 2014-11-13; Value: 1.0pF; Supplier: *; Supplier part number: *; 2nd source Supplier: *; 2nd source part number: *; Footprint Doc: 0201; Artikkelnr Simpro: N.A.
L2#2 = L0603-10µ: as L2#1 on sheet Disarmer; Part Number: L0603-10µ; Datasheet: http://www.yuden.co.jp/ut/product/pdf/elb2_e.pdf; LatestRevisionDate: 2012-09-19; Pin Count: 2; Publisher: Nordic Semiconductor; Published: 2010-02-24; Value: 10µH; Supplier: Digi-Key; Supplier part number: 587-1714-1-ND; 2nd source Supplier: Farnell; Footprint Doc: 0603
L3#2 = L0402-15n: as L3#1 on sheet Disarmer; Part Number: L0402-15n; LatestRevisionDate: 2012-09-19; Pin Count: 2; Publisher: Nordic Semiconductor; Published: 2010-07-12; Value: 15nH; Note: High frequency chip inductor ±10%; Supplier: Digi-Key; Datasheet: http://www.yuden.co.jp/productdata/catalog/en/mlci04_e.pdf; Supplier part number: 587-1521-1-ND; 2nd source Supplier: Farnell; Footprint Doc: 0402
L?#4 = L0402-15n: High frequency chip inductor ±10%; Supplier 1: Farnell; Supplier Part Number 1: 2285742
L?#5 = L0201-3n3: as L1 on sheet Disarmer; Part Number: L0201-3n3; Manufacturer: *; Manufacturer Part Number: *; Datasheet: *; LatestRevisionDate: 2013-04-10; Pin Count: 2; Publisher: Nordic Semiconductor; Published: 2013-04-10; Value: 3.3nH; Note: High frequency chip inductor ±5%; Supplier: *; Supplier part number: *; 2nd source Supplier: *; 2nd source part number: *; Footprint Doc: 0201; Artikkelnr Simpro: N.A.
LD?#3-LD?#5 = LED_0603_Blue: Supplier 1: Digi-Key; Supplier 2: TME; Supplier 3: TME; Supplier 4: TME; Supplier 5: TME; Supplier Part Number 1: 160-1647-2-ND; Supplier Part Number 2: LL-S192PBC-B4-1B; Supplier Part Number 3: LL-S194PBC-B4-1B; Supplier Part Number 4: OF-SMD1608B; Supplier Part Number 5: OSB50603C1D
P2#2 = TC2030-CTX-NL: as P2#1 on sheet Disarmer; Part Number: TC2030-CTX-NL; Manufacturer Part Number: TC2030-CTX-NL; Datasheet: http://www.tag-connect.com/Materials/TC2030-IDC-NL.pdf; LatestRevisionDate: 2013-08-08; Pin Count: 6; Publisher: Nordic Semiconductor; Published: 2013-08-08; Value: TC2030-CTX-NL; Supplier: Tag-Connect; Supplier part number: TC2030-CTX-NL; 2nd source Supplier: *; 2nd source part number: *
P?#2 = Header 4: Header, 4-Pin; LatestRevisionDate: 17-Jul-2002; LatestRevisionNote: Re-released for DXP Platform.; Publisher: Altium Limited
SMA_connector#1 SMA_connector#2 = Component_1: Supplier 1: Farnell; Supplier Part Number 1: 4194615
U1#2 = nRF52832-CIAA: as U1#1 on sheet Disarmer; Part Number: nRF52832-CIAA; Manufacturer Part Number: nRF52832-CIAA; Datasheet: *; LatestRevisionDate: 2016-03-11; Pin Count: 54; Publisher: Nordic Semiconductor; Published: 2016-03-11; Value: nRF52832-CIAA; Note: *; Supplier: Nordic Semiconductor; Supplier part number: *; 2nd source Supplier: *; 2nd source part number: *; Footprint Doc: WLCSP_C50; Artikkelnr Simpro: N.A.; Part number IPS: N.A.
X?#3 = XTAL_SMD2012_32.768kHz_9pF_Seiko: as X?#1 on sheet Disarmer; Part Number: XTAL_SMD2012_32.768kHz_9pF_Seiko; Datasheet: http://www.sii.co.jp/en/quartz/files/2013/03/file_PRODUCT_MASTER_50811_GRAPHIC03.pdf; LatestRevisionDate: 2015-10-15; Pin Count: 2; Publisher: Nordic Semiconductor; Published: 2015-10-15; Value: 32.768kHz; Supplier: *; Supplier part number: *; 2nd source Supplier: *; 2nd source part number: *; Footprint Doc: XTAL_2012; Artikkelnr Simpro: N.A.
X?#4 = XTAL_SMD2016_32MHz_8pF_Epson: as X1 on sheet Disarmer; Part Number: XTAL_SMD2016_32MHz_8pF_Epson; Datasheet: http://www.epsondevice.com/docs/qd/en/DownloadServlet?id=ID000449; LatestRevisionDate: 2014-11-27; Pin Count: 4; Publisher: Nordic Semiconductor; Published: 2012-03-09; Value: 32MHz; Supplier: Farnell; Supplier part number: 171-2806; 2nd source Supplier: *; 2nd source part number: *; Footprint Doc: XTAL_2016; Artikkelnr Simpro: N.A.
ANT?#2 = 2450AT43B100: Supplier 1: Mouser; Supplier 2: Farnell; Supplier 3: Farnell; Supplier 4: Digi-Key; Supplier 5: Digi-Key; Supplier 6: Digi-Key; Supplier Part Number 1: 609-2450AT43B100E; Supplier Part Number 2: 2148524; Supplier Part Number 3: 2148524RL; Supplier Part Number 4: 712-1010-2-ND; Supplier Part Number 5: 712-1010-1-ND; Supplier Part Number 6: 712-1010-6-ND
LSM303C = LSM303C: Supplier 1: Farnell
Q?#4-Q?#11 = RZE002P02TLTR-ND: Supplier 1: Digi-Key; Supplier 2: Digi-Key; Supplier 3: Digi-Key; Supplier Part Number 1: RZE002P02TLTR-ND; Supplier Part Number 2: RZE002P02TLCT-ND; Supplier Part Number 3: RZE002P02TLDKR-ND; Value: RZE002P02TL
R?#13-R?#32 = RES_0402_1k: Supplier 1: Digi-Key; Supplier 2: Farnell; Supplier 3: Mouser; Supplier Part Number 1: 311-1.0KJRTR-ND; Supplier Part Number 2: 1358043; Supplier Part Number 3: 603-RC0402FR-071KL

## Sheet MainBoardPower.SchDoc
size A4
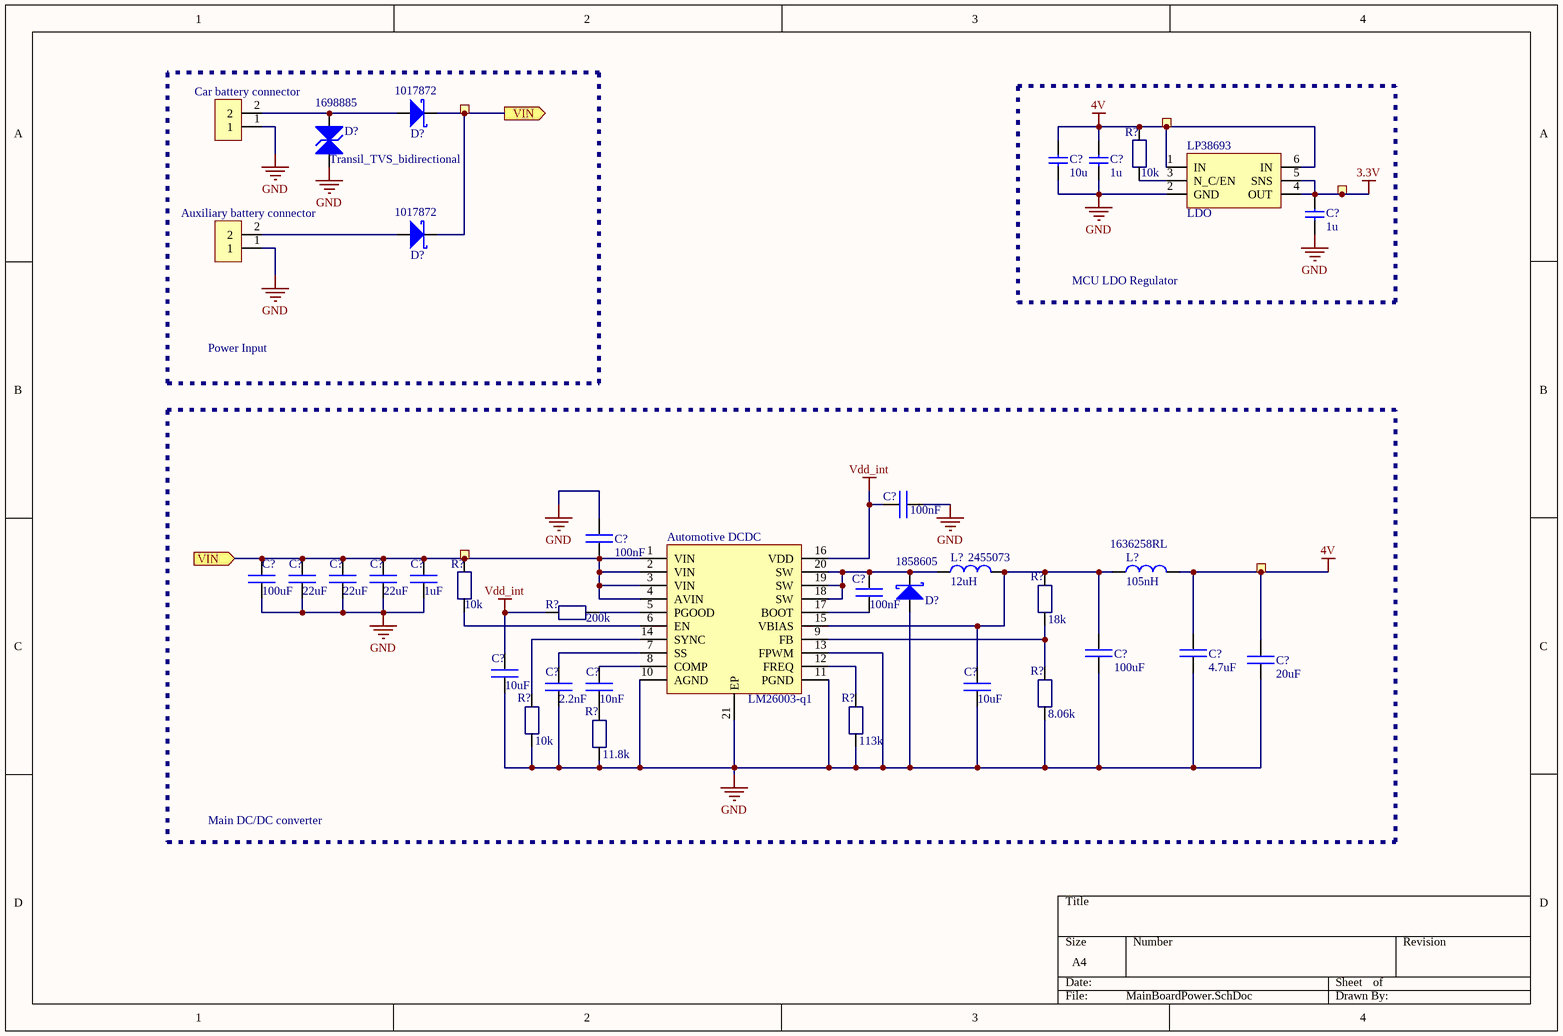
[diagram p2: MainBoardPower.SchDoc]

### Parts
(Parts that share a designator on the sheet are numbered #1, #2 ... from top to bottom, then left to right.)
?#32  Ø1.0mm,SMD  [TP_SMD_Ř1.0mm]  (value not drawn)  (no BOM)
?#33  Ø1.0mm,SMD  [TP_SMD_Ř1.0mm]  (value not drawn)  (no BOM)
?#34  Ø1.0mm,SMD  [TP_SMD_Ř1.0mm]  (value not drawn)  (no BOM)
?#35  Ø1.0mm,SMD  [TP_SMD_Ř1.0mm]  (value not drawn)  (no BOM)
?#36  Ø1.0mm,SMD  [TP_SMD_Ř1.0mm]  (value not drawn)  (no BOM)
Auxiliary_battery_connector  (no value)  [ARK_3.5mm]
C?#68  10u  [CAPC1608X06L]
C?#69  1u  [CAPC1608X06L]
C?#70  1u  [CAPC1608X06L]
C?#71  100nF  [0402]
C?#72  100nF  [0402]
C?#73  100uF  [1206]
C?#74  22uF  [0805]
C?#75  22uF  [0805]
C?#76  22uF  [0805]
C?#77  1uF  [0402]
C?#78  100nF  [0805]
C?#79  100uF  [1206]
C?#80  4.7uF  [0603]
C?#81  20uF  [0805]
C?#82  10uF  [0805]
C?#83  2.2nF  [0805]
C?#84  10nF  [0805]
C?#85  10uF  [0805]
Car_battery_connector  (no value)  [ARK_3.5mm]
D?#3  Supplier Part Number 1: 1017872  [DO-214-AA]  (hidden comment: Shottky_DO-214-AA)
D?#4  Transil_TVS_bidirectional  Supplier Part Number 1: 1698885  [DO-214-AB]
D?#5  Supplier Part Number 1: 1017872  [DO-214-AA]  (hidden comment: Shottky_DO-214-AA)
D?#6  Supplier Part Number 1: 1858605  [SMA]  (hidden comment: Shottky)
L?#6  12uH  Supplier Part Number 1: 2455073  [SRR1210A]
L?#7  105nH  Supplier Part Number 1: 1636258RL  [7.15mm x 7mm x 5mm]
LM26003-q1  Automotive DCDC  [TSSOP20_footprint]
LP38693#2  LDO  [WSON-6]
R?#33  value 10k  [RES_0402]  (hidden comment: RES_0402_1k)
R?#34  value 10k  [RES_0402]  (hidden comment: RES_0402_1k)
R?#35  value 18k  [RES_0402]  (hidden comment: RES_0402_1k)
R?#36  value 200k  [RES_0402]  (hidden comment: RES_0402_1k)
R?#37  value 8.06k  [RES_0402]  (hidden comment: RES_0402_1k)
R?#38  value 10k  [RES_0402]  (hidden comment: RES_0402_1k)
R?#39  value 113k  [RES_0402]  (hidden comment: RES_0402_1k)
R?#40  value 11.8k  [RES_0402]  (hidden comment: RES_0402_1k)

### Blocks framed on the sheet
Power Input: ?#32 Auxiliary_battery_connector Car_battery_connector D?#3-D?#5
MCU LDO Regulator: ?#33 ?#34 C?#68-C?#70 LP38693#2 R?#33
Main DC/DC converter: ?#35 ?#36 C?#71-C?#85 D?#6 L?#6 L?#7 LM26003-q1 R?#34-R?#40

### Ports
VIN (in), VIN (out)

### Nets
3.3V: ?#34.1 C?#70.1 LP38693#2.4(OUT) LP38693#2.5(SNS)
4V: ?#33.1 ?#36.1 C?#68.1 C?#69.1 C?#80.1 C?#81.2 L?#7.2 LP38693#2.1(IN) LP38693#2.6(IN) R?#33.2
GND: Auxiliary_battery_connector.1 C?#68.2 C?#69.2 C?#70.2 C?#71.2 C?#72.2 C?#73.1 C?#74.1 C?#75.1 C?#76.1 C?#77.1 C?#79.1 C?#80.2 C?#81.1 C?#82.1 C?#83.1 C?#85.1 Car_battery_connector.1 D?#4.1 D?#6.1 LM26003-q1.10(AGND) LM26003-q1.11(PGND) LM26003-q1.13(FPWM) LM26003-q1.21(EP) LP38693#2.2(GND) R?#37.2 R?#38.2 R?#39.2 R?#40.2
Vdd_int: C?#71.1 C?#82.2 LM26003-q1.16(VDD) R?#36.2
Net?#32_1: ?#32.1 ?#35.1 C?#72.1 C?#73.2 C?#74.2 C?#75.2 C?#76.2 C?#77.2 D?#3.2 D?#5.2 LM26003-q1.1(VIN) LM26003-q1.2(VIN) LM26003-q1.3(VIN) LM26003-q1.4(AVIN) R?#34.1 ; port VIN
NetAuxiliary_battery_connector_2: Auxiliary_battery_connector.2 D?#5.1
NetC?#78_1: C?#78.1 LM26003-q1.17(BOOT)
NetC?#78_2: C?#78.2 D?#6.2 L?#6.1 LM26003-q1.18(SW) LM26003-q1.19(SW) LM26003-q1.20(SW)
NetC?#79_2: C?#79.2 C?#85.2 L?#6.2 L?#7.1 LM26003-q1.15(VBIAS) R?#35.1
NetC?#83_2: C?#83.2 LM26003-q1.7(SS)
NetC?#84_1: C?#84.1 R?#40.1
NetC?#84_2: C?#84.2 LM26003-q1.8(COMP)
NetCar_battery_connector_2: Car_battery_connector.2 D?#3.1 D?#4.2
NetLM26003-q1_5: LM26003-q1.5(PGOOD) R?#36.1
NetLM26003-q1_6: LM26003-q1.6(EN) R?#34.2
NetLM26003-q1_9: LM26003-q1.9(FB) R?#35.2 R?#37.1
NetLM26003-q1_12: LM26003-q1.12(FREQ) R?#39.1
NetLM26003-q1_14: LM26003-q1.14(SYNC) R?#38.1
NetLP38693#2_3: LP38693#2.3(N_C/EN) R?#33.1

### Library data of the parts
?#32-?#36 = TESTPAD: as ?#1 on sheet Disarmer; Manufacturer Part Number: *; Datasheet: *; Footprint: TP_SMD_Ø1.0mm; LatestRevisionDate: 2013-06-11; Pin Count: 1; Publisher: Nordic Semiconductor; Published: 2013-06-11; Value: Ø1.0mm,SMD; Note: *; Supplier: *; Supplier part number: *; 2nd source Supplier: *; 2nd source part number: *
Auxiliary_battery_connector Car_battery_connector = Component_1
C?#68-C?#70 = C0603-4µ7: as C?#1 on sheet Disarmer; Part Number: C0603-4µ7; Manufacturer: *; Manufacturer Part Number: *; Datasheet: *; LatestRevisionDate: 2009-11-23; Pin Count: 2; Publisher: Nordic Semiconductor; Published: 2009-05-08; Supplier: *; Supplier part number: *; 2nd source Supplier: *; 2nd source part number: *; Footprint Doc: 0603; Supplier 1: Farnell; Supplier Part Number 1: 1327684
C?#71-C?#85 = Capacitor_MLCC: ?
D?#4 = TVS_bidirectional: TVS_bi; Supplier 1: Farnell
D?#6 = Shottky_diode: Supplier 1: Farnell
L?#6 L?#7 = Inductor: Supplier 1: Farnell
LM26003-q1 = LM26003-q1
LP38693#2 = LP38693 WSON Package
D?#3 D?#5 = Shottky_DO-214-AA: Supplier 1: Farnell
R?#33-R?#40 = RES_0402_1k: Supplier 1: Digi-Key; Supplier 2: Farnell; Supplier 3: Mouser; Supplier Part Number 1: 311-1.0KJRTR-ND; Supplier Part Number 2: 1358043; Supplier Part Number 3: 603-RC0402FR-071KL

## Nets that join several sheets
3.3V: Disarmer (16 pins), MainBoard (15 pins), MainBoardPower (?#34.1 C?#70.1 LP38693#2.4 LP38693#2.5)
4V: MainBoard (?#31.5 C?#67.2 Q?#4.3 Q?#8.3), MainBoardPower (10 pins)
GND: Disarmer (65 pins), MainBoard (62 pins), MainBoardPower (29 pins)
NetP?#1_1: Disarmer (P?#1.1 U1#1.E2), MainBoard (P?#2.1 Q?#7.1 U1#2.E2)
NetP?#1_2: Disarmer (P?#1.2 U1#1.F2), MainBoard (P?#2.2 Q?#6.1 U1#2.F2)
P0.18: Disarmer (P?#1.3 U1#1.H2), MainBoard (P?#2.3 U1#2.H2)